# EAGLE design Uni_Ali_001 (EAGLE 7.2.0)
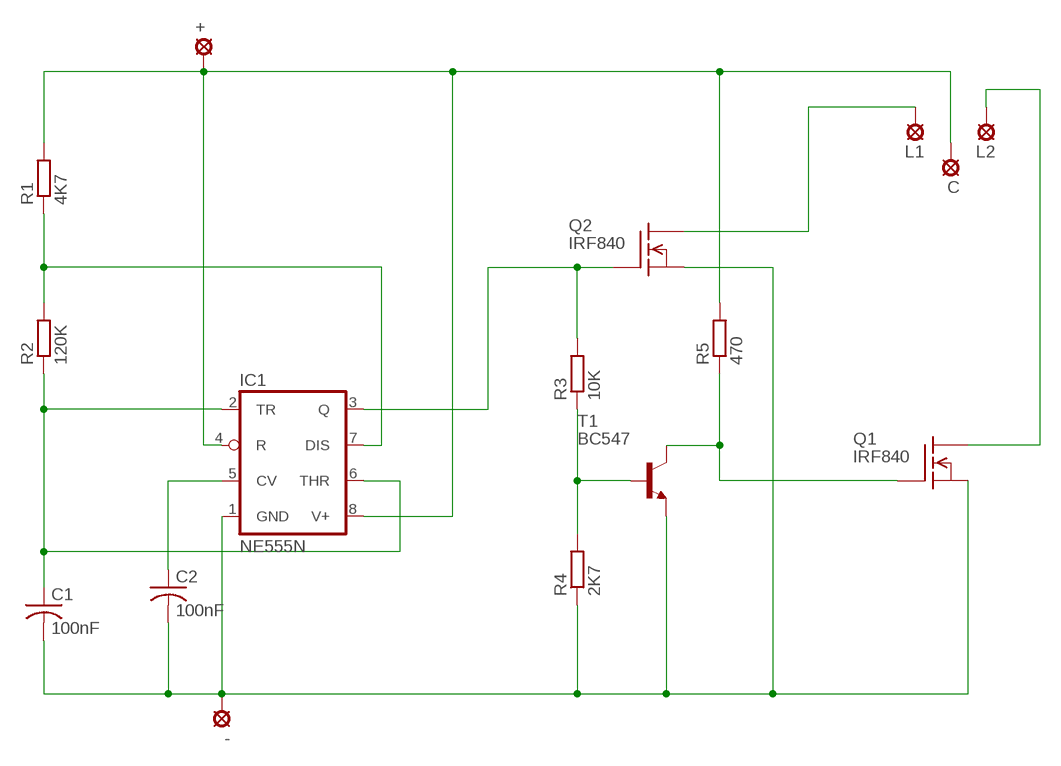
[diagram p0: schematic, sheet 1]

## Parts
+  LSP10  [LSP10]
-  LSP10  [LSP10]
C  LSP10  [LSP10]
C1  100nF  C-US025-024X044  [C025-024X044]
C2  100nF  C-US025-024X044  [C025-024X044]
IC1  NE555N  [DIL08]
L1  LSP10  [LSP10]
L2  LSP10  [LSP10]
Q1  IRF840  [TO220]
Q2  IRF840  [TO220]
R1  4K7  R-EU_0204/7  [0204/7]
R2  120K  R-EU_0204/7  [0204/7]
R3  10K  R-EU_0204/7  [0204/7]
R4  2K7  R-EU_0204/7  [0204/7]
R5  470  R-EU_0204/7  [0204/7]
T1  BC547  [TO92]

## Nets
N$1: L2.MP Q1.2(D)
N$2: L1.MP Q2.2(D)
N$4: IC1.7(DIS) R1.1 R2.2
N$5: C1.1 IC1.2(TR) IC1.6(THR) R2.1
N$7: R3.1 R4.2 T1.2(B)
N$9: Q1.1(G) R5.1 T1.3(C)
N$10: -.MP C1.2 C2.2 IC1.1(GND) Q1.3(S) Q2.3(S) R4.1 T1.1(E)
N$11: C2.1 IC1.5(CV)
N$14: IC1.3(Q) Q2.1(G) R3.2
N$15: +.MP C.MP IC1.4(R) IC1.8(V+) R1.2 R5.2

## Library data of the parts
+ - C L1 L2 = solpad:LSP10: SOLDER PAD drill 1.0 mm, distributor Buerklin, 12H555
C1 C2 = rcl:C-US: CAPACITOR, American symbol
IC1 = linear:*555: TIMER
Q1 Q2 = transistor-fet:IRF840: N-Channel Enhancement MOSFET (HEXFET); 500V; 8A; 0,85Ohm
R1-R5 = rcl:R-EU_: RESISTOR, European symbol
T1 = transistor:BC547: NPN TRANSISTOR

## Board
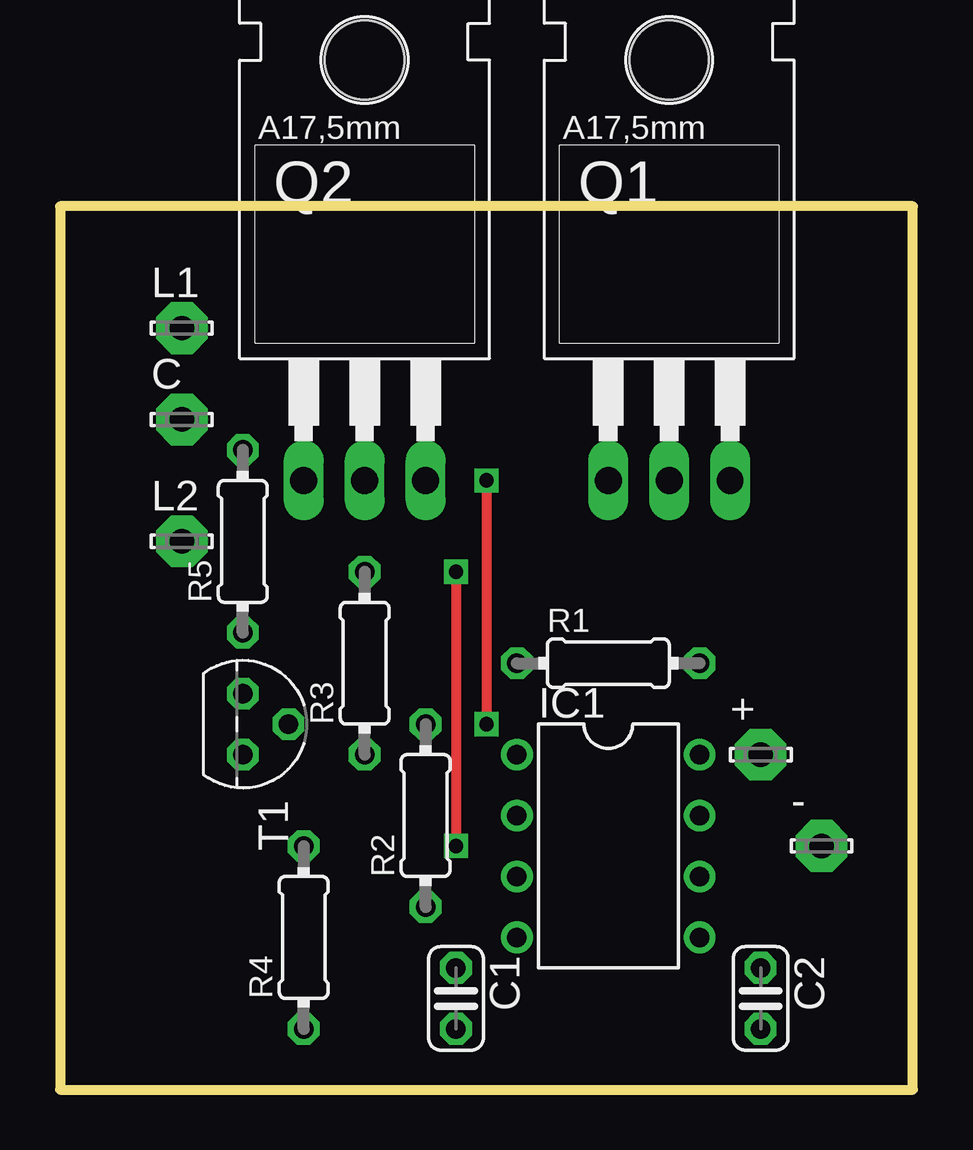
[diagram p1: board, top side]
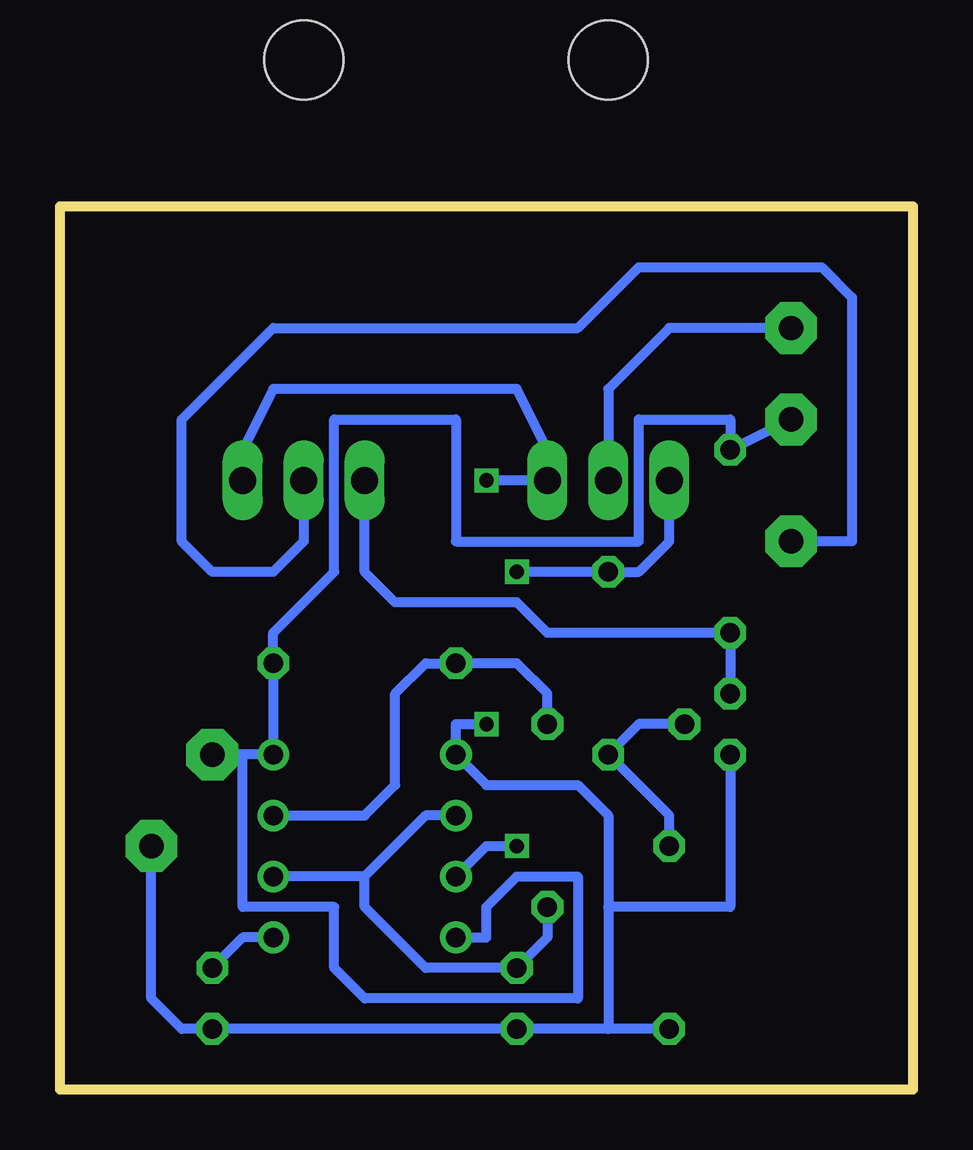
[diagram p2: board, bottom side, seen from below]

Size 35.56 x 36.83 mm. Coordinates in mm from the lower left corner, seen from the top.
Outline: 0,36.83 0,0 35.56,0 35.56,36.83 0,36.83
Copper layers (1*16): Top 0.035mm / dielectric 1.5mm / Bottom 0.035mm
Design rules "default": minimum track width 10mil, minimum drill 24mil, track to track 8mil, track to pad 8mil, pad to pad 8mil, via to via 8mil, smd to smd 8mil, copper to edge 40mil, drill to drill 8mil, minimum pad ring 10mil, minimum via ring 8mil, stop-mask expansion 4mil, vias tented up to drill 0mil, thermal gap 10mil

### Footprints (pad centres in the part's own frame; a part is rotated, then mirrored left to right if it is on the bottom)
LSP10 = drill 1.016 pad 2.159 octagon: MP 0,0
C025-024X044 = drill 0.813 octagon: 1 -1.27,0; 2 1.27,0
DIL08 = drill 0.813 pad 1.27: 1 -3.81,-3.81; 2 -1.27,-3.81; 3 1.27,-3.81; 4 3.81,-3.81; 5 3.81,3.81; 6 1.27,3.81; 7 -1.27,3.81; 8 -3.81,3.81
TO220 = drill 1.118 long: 1 -2.54,-6.35; 2 0,-6.35; 3 2.54,-6.35 | hole 3.302: 0,11.176
0204/7 = drill 0.813 octagon: 1 -3.81,0; 2 3.81,0
TO92 = drill 0.813 octagon: 1 1.27,0; 2 0,1.905; 3 -1.27,0

### Placement (x,y rotation side)
+  29.21,13.97 0 top
-  31.75,10.16 0 top
C  5.08,27.94 0 top
C1  16.51,3.81 270 top
C2  29.21,3.81 270 top
IC1  22.86,10.16 270 top
L1  5.08,31.75 0 top
L2  5.08,22.86 0 top
Q1  25.4,31.75 0 top
Q2  12.7,31.75 0 top
R1  22.86,17.78 0 top
R2  15.24,11.43 90 top
R3  12.7,17.78 90 top
R4  10.16,6.35 90 top
R5  7.62,22.86 90 top
T1  7.62,15.24 270 top

### Tracks (layer width: path | path; a pad name or v marks a point on that pad's centre or on a via)
N$1
  Bottom 0.406: Q1.2 25.4,22.86 26.67,21.59 29.21,21.59 30.48,22.86 30.48,27.94 26.67,31.75 13.97,31.75 11.43,34.29 3.81,34.29 2.54,33.02 2.54,22.86 L2.MP
N$2
  Bottom 0.406: L1.MP 10.16,31.75 12.7,29.21 Q2.2
N$4
  Bottom 0.406: R2.2 15.24,16.51 16.51,17.78 R1.1 20.32,17.78 21.59,16.51 21.59,12.7 22.86,11.43 IC1.7
N$5
  Bottom 0.406: IC1.2 20.32,11.43 22.86,8.89 | 22.86,8.89 IC1.6 | R2.1 15.24,6.35 C1.1 20.32,5.08 22.86,7.62 22.86,8.89
N$7
  Bottom 0.406: T1.2 11.43,15.24 R3.1 10.16,11.43 R4.2
N$9
  Bottom 0.406: T1.3 R5.1 15.24,19.05 16.51,20.32 21.59,20.32 22.86,21.59 Q1.1
N$10  (via drill 0.6)
  Top 0.406: v17.78,25.4 v17.78,15.24
  Bottom 0.406: 12.7,7.62 12.7,11.43 13.97,12.7 17.78,12.7 IC1.1 19.05,15.24 v17.78,15.24 | 12.7,7.62 12.7,2.54 | 12.7,2.54 C1.2 C2.2 30.48,2.54 31.75,3.81 -.MP | R4.1 12.7,2.54 | T1.1 7.62,7.62 12.7,7.62 | Q1.3 27.94,26.67 26.67,29.21 16.51,29.21 15.24,26.67 Q2.3 v17.78,25.4
N$11
  Bottom 0.406: IC1.5 27.94,6.35 C2.1
N$14  (via drill 0.6)
  Top 0.406: v16.51,21.59 v16.51,10.16
  Bottom 0.406: Q2.1 10.16,22.86 11.43,21.59 R3.2 v16.51,21.59 | IC1.3 17.78,10.16 v16.51,10.16
N$15
  Bottom 0.406: 27.94,13.97 IC1.8 R1.2 26.67,19.05 24.13,21.59 24.13,27.94 19.05,27.94 19.05,22.86 11.43,22.86 11.43,27.94 7.62,27.94 R5.2 C.MP | 27.94,13.97 +.MP | IC1.4 17.78,6.35 17.78,7.62 16.51,8.89 13.97,8.89 13.97,3.81 22.86,3.81 24.13,5.08 24.13,7.62 27.94,7.62 27.94,13.97